# Altium schematic sheet sound.SchDoc: Thymio2
size A4; Organization: Original design LSRO-STI-EPFL; Address1: Association Mobsya; Address2: Michael Bonani; Address3: Ch. Closel 3; Address4: CH-1020 Renens; DocumentNumber: 8; Revision: 2.3; SheetNumber: 8; SheetTotal: 9; Engineer: Michael Bonani; Title2: PCB principal; ProjectName: Name of the project
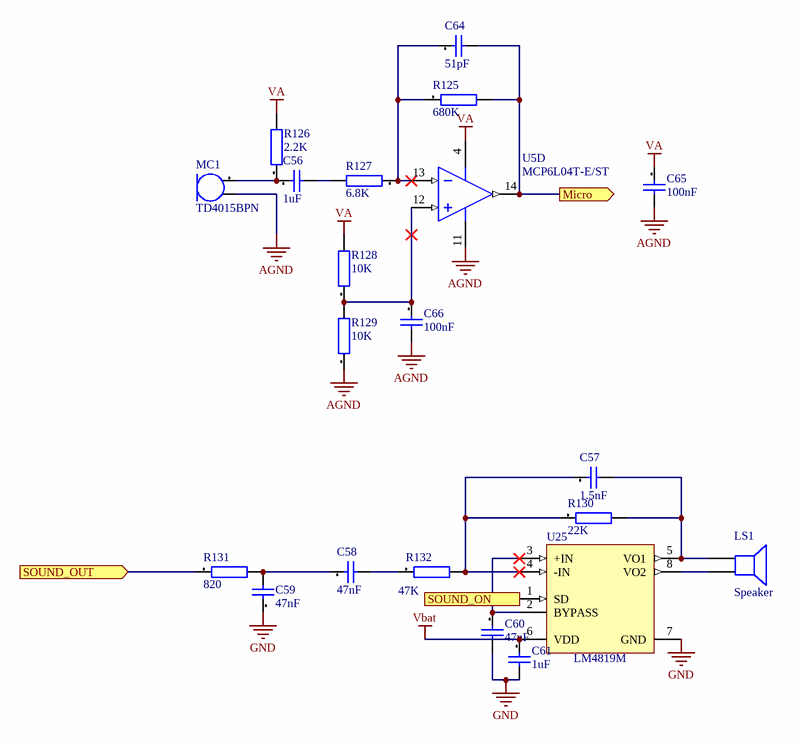
[diagram p0: sound.SchDoc]

## Parts
C56  1uF  [CAPC1005X05N]
C57  1.5nF  [CAPC1005X05N]
C58  47nF  [CAPC1005X05N]
C59  47nF  [CAPC1005X05N]
C60  47nF  [CAPC1005X05N]
C61  1uF  [CAPC1005X05N]
C64  51pF  [CAPC1005X05N]
C65  100nF  [CAPC1005X05N]
C66  100nF  [CAPC1005X05N]
LS1  Speaker  [PIN2]
MC1  TD4015BPN  [MICRO_TD4015BPN]
R125  680K  [RESC1005X04N]
R126  2.2K  [RESC1005X04N]
R127  6.8K  [RESC1005X04N]
R128  10K  [RESC1005X04N]
R129  10K  [RESC1005X04N]
R130  22K  [RESC1005X04N]
R131  820  [RESC1005X04N]
R132  47K  [RESC1005X04N]
U5  MCP6L04T-E/ST  [TSSOP-ST14_N]  (part D of 4)
U25  LM4819M  [M08A_N]

## Ports
Micro (out), SOUND_ON (in), SOUND_OUT (in)

## Nets
AGND: C65.2 C66.2 MC1.2 R129.1 U5.11(VSS)
GND: C59.1 C60.2 C61.2 U25.7(GND)
VA: C65.1 R126.2 R128.2 U5.4(VDD)
Vbat: C61.1 U25.6(VDD)
Micro: C64.2 R125.2 U5.14(VOUTD) ; port Micro
SOUND_ON: U25.1(SD) ; port SOUND_ON
SOUND_OUT: R131.1 ; port SOUND_OUT
NetC56_1: C56.1 MC1.1 R126.1
NetC56_2: C56.2 R127.2
NetC57_1: C57.1 R130.1 R132.2 U25.4(-IN)
NetC57_2: C57.2 LS1.2 R130.2 U25.5(VO1)
NetC58_1: C58.1 C59.2 R131.2
NetC58_2: C58.2 R132.1
NetC60_1: C60.1 U25.2(BYPASS) U25.3(+IN)
NetC64_1: C64.1 R125.1 R127.1 U5.13(VIND-)
NetC66_1: C66.1 R128.1 R129.2 U5.12(VIND+)
NetLS1_1: LS1.1 U25.8(VO2)

## Notes on the sheet
- Date:
- Project
- Part
- Revision:
- File :
- Page
- de

## Library data of the parts
C56 = 4.7uF[[/\]]0603[[/\]]1: Capacitor; Manufacturer: Kemet; Manufacturer Nr: C0603C475K9PAC; Preference: 1; Tolerance +: +10; Tolerance -: -10; Dielectric: X5R; Voltage: 6.3; MaxTemperature: +85; MinTemperature: -55; Quant_1: 10; Quant_2: 100; Quant_3: 1000; Quant_4: 4000; Currentie: CHF; LayerSch: Top; Size: 0603; Footprint Acort: 0603_G; Supplier: Farnell; Supplier Nr: 9227784; ComponentLink2Description: Farnell link; ComponentLink2URL: http://ch.farnell.com/jsp/displayProduct.jsp?sku=9227784; Price_1: 0.33; Price_2: 0.298; Price_3: 0.278; Price_4: 0.246; ROHS: True; DateLastUpdate: 2007-12-03 / 14:22:57
C57 C59 C64 = 10nF[[/\]]0603[[/\]]1: Capacitor; Manufacturer: Multicomp; Manufacturer Nr: U0603R103KCT; Preference: 1; Tolerance +: +10; Tolerance -: -10; Dielectric: X7R; Voltage: 50; MaxTemperature: +125; MinTemperature: -55; Quant_1: 10; Quant_2: 100; Quant_3: 1000; Currentie: CHF; LayerSch: Top; Size: 0603; Footprint Acort: 0603_G; Supplier: Farnell; Supplier Nr: 9406182; ComponentLink2Description: Farnell link; ComponentLink2URL: http://ch.farnell.com/jsp/displayProduct.jsp?sku=9406182; Price_1: 0.062; Price_2: 0.041; Price_3: 0.021; ROHS: True; DateLastUpdate: 2007-12-03 / 14:22:34
C58 C60 = 470nF[[/\]]0603[[/\]]1: Capacitor; Manufacturer: Murata; Manufacturer Nr: GRM188R61C474K; Preference: 1; Tolerance +: +10; Tolerance -: -10; Dielectric: X5R; Voltage: 16; MaxTemperature: +85; MinTemperature: -55; Quant_1: 10; Quant_2: 100; Quant_3: 500; Currentie: CHF; LayerSch: Top; Size: 0603; Footprint Acort: 0603_G; Supplier: Distrelec; Supplier Nr: 823494; ComponentLink2Description: Distrelec link; ComponentLink2URL: http://www.distrelec.com/ishopWebFront/search/luceneSearch.do?dispatch=find&showImage=on&artnrPhrase=823494; Price_1: 0.1797; Price_2: 0.1474; Price_3: 0.1162; ROHS: True; DateLastUpdate: 2007-12-03 / 14:23:01
C61 = 1uF[[/\]]0603[[/\]]1: Capacitor; Manufacturer: Murata; Manufacturer Nr: GRM188R61E105K; Preference: 1; Tolerance +: +10; Tolerance -: -10; Dielectric: X5R; Voltage: 25; MaxTemperature: +85; MinTemperature: -55; Quant_1: 10; Quant_2: 100; Quant_3: 500; Currentie: CHF; LayerSch: Top; Size: 0603; Footprint Acort: 0603_G; Supplier: Distrelec; Supplier Nr: 823495; ComponentLink2Description: Distrelec link; ComponentLink2URL: http://www.distrelec.com/ishopWebFront/search/luceneSearch.do?dispatch=find&showImage=on&artnrPhrase=823495; Price_1: 0.1797; Price_2: 0.1474; Price_3: 0.1162; ROHS: True; DateLastUpdate: 2007-12-03 / 14:22:46
C65 C66 = 100nF[[/\]]0603[[/\]]1: Capacitor; Manufacturer: Kemet; Manufacturer Nr: C0603C104K5RAC; Preference: 1; Tolerance +: +10; Tolerance -: -10; Dielectric: X7R; Voltage: 50; MaxTemperature: +125; MinTemperature: -55; Quant_1: 10; Quant_2: 100; Quant_3: 1000; Quant_4: 4000; Currentie: CHF; LayerSch: Top; Size: 0603; Footprint Acort: 0603_G; Supplier: Farnell; Supplier Nr: 1288255; ComponentLink2Description: Farnell link; ComponentLink2URL: http://ch.farnell.com/jsp/displayProduct.jsp?sku=1288255; Price_1: 0.046; Price_2: 0.04; Price_3: 0.037; Price_4: 0.036; ROHS: True; DateLastUpdate: 2007-12-03 / 14:22:31
LS1 = Speaker: Loudspeaker; LayerSch: Top; Published: 24-Mar-1999; LatestRevisionDate: 17-Jul-2002; LatestRevisionNote: Re-released for DXP Platform.; PackageReference: PIN2; Publisher: Altium Limited
MC1 = Micro1: Omnidirectional Back Electret Condenser Microphone; LayerSch: Top
R125 = 470K[[/\]]0603[[/\]]1: Resistor; Manufacturer: Vishay; Manufacturer Nr: D11CRCW06030B4703F; Tolerance: +/-1; Preference: 1; Power: 0.1; Voltage: 75; Current: 1.5; ppm/K: +/-100; Quant_1: 10; Quant_2: 100; Quant_3: 500; Currentie: CHF; LayerSch: Top; Size: 0603; Footprint Acort: 0603; Supplier: Distrelec; Supplier Nr: 715652; ComponentLink2Description: Distrelec link; ComponentLink2URL: http://www.distrelec.com/ishopWebFront/search/luceneSearch.do?dispatch=find&showImage=on&artnrPhrase=715652; ROHS: True; Price_1: 0.0538; Price_2: 0.0323; Price_3: 0.0204; DateLastUpdate: 2007-12-03 / 16:30:19
R126 = 2.2K[[/\]]0603[[/\]]1: Resistor; Manufacturer: Vishay; Manufacturer Nr: D11CRCW06030B2201F; Tolerance: +/-1; Preference: 1; Power: 0.1; Voltage: 75; Current: 1.5; ppm/K: +/-100; Quant_1: 10; Quant_2: 100; Quant_3: 500; Currentie: CHF; LayerSch: Top; Size: 0603; Footprint Acort: 0603; Supplier: Distrelec; Supplier Nr: 715596; ComponentLink2Description: Distrelec link; ComponentLink2URL: http://www.distrelec.com/ishopWebFront/search/luceneSearch.do?dispatch=find&showImage=on&artnrPhrase=715596; ROHS: True; Price_1: 0.085; Price_2: 0.0603; Price_3: 0.0247; DateLastUpdate: 2009-06-10 / 12:36:43
R127-R129 = 10K[[/\]]0603[[/\]]1: Resistor; Manufacturer: Vishay; Manufacturer Nr: D11CRCW06030B1002F; Tolerance: +/-1; Preference: 1; Power: 0.1; Voltage: 75; Current: 1.5; ppm/K: +/-100; Quant_1: 10; Quant_2: 100; Quant_3: 500; Currentie: CHF; LayerSch: Top; Size: 0603; Footprint Acort: 0603; ComponentLink1Description: OnLine datasheet; Supplier: Distrelec; Supplier Nr: 715612; ComponentLink2Description: Distrelec link; ComponentLink2URL: http://www.distrelec.com/ishopWebFront/search/luceneSearch.do?dispatch=find&showImage=on&artnrPhrase=715612; ROHS: True; Price_1: 0.0538; Price_2: 0.0323; Price_3: 0.0204; DateLastUpdate: 2007-12-03 / 16:29:57
R130-R132 = 22K[[/\]]0603[[/\]]1: Resistor; Manufacturer: Vishay; Manufacturer Nr: D11CRCW06030B2202F; Tolerance: +/-1; Preference: 1; Power: 0.1; Voltage: 75; Current: 1.5; ppm/K: +/-100; Quant_1: 10; Quant_2: 100; Quant_3: 500; Currentie: CHF; LayerSch: Top; Size: 0603; Footprint Acort: 0603; Supplier: Distrelec; Supplier Nr: 715620; ComponentLink2Description: Distrelec link; ComponentLink2URL: http://www.distrelec.com/ishopWebFront/search/luceneSearch.do?dispatch=find&showImage=on&artnrPhrase=715620; ROHS: True; Price_1: 0.0538; Price_2: 0.0323; Price_3: 0.0204; DateLastUpdate: 2007-12-03 / 16:30:04
U5 = MCP6L04T-E/ST: 1 MHz, 85 µA Quad Op Amp, 14-Pin TSSOP, Extended Temperature Range, Tape and Reel; LayerSch: Top; FirstPublished: 2-Dec-2009; DatasheetVersion: revA, Mar-2009; PackageVersion: revBB, Aug-2009; PackageReference: TSSOP-ST14; Publisher: Altium Limited; PackageDescription: 14-Lead Plastic Thin Shrink Small Outline (ST) - 4.4mm Body [TSSOP]; Supplier 1: Digi-Key; Supplier Part Number 1: MCP6L04T-E/STTR-ND; Supplier 2: Digi-Key; Supplier Part Number 2: MCP6L04T-E/STDKR-ND; Supplier 3: Digi-Key; Supplier Part Number 3: MCP6L04T-E/STCT-ND; Supplier 4: Newark; Supplier Part Number 4: 08R1815; ComponentLink1Description: Datasheet; ComponentLink1URL: http://ww1.microchip.com/downloads/en/DeviceDoc/22140a.pdf; ComponentLink2Description: Packaging Specification; ComponentLink2URL: http://www.microchip.com/stellent/groups/techpub_sg/documents/packagingspec/en012702.pdf; ComponentLink3Description: Microchip.com Home; ComponentLink3URL: http://www.microchip.com/
U25 = LM4819M: 350mW Audio Power Amplifier with Shutdown Mode; Manufacturer: National Semiconductor; CompType: Audio IC; PackageTopMarking: NSZXTT*LM48*19M; LayerSch: Top; Published: 4-Dec-2008; DatasheetVersion: Apr-2002; PackageVersion: revL, Sep-2006; PackageReference: M08A; Publisher: Altium Limited; PackageDescription: SOIC Narrow, 4.9 x 3.9 x 1.45mm, 8 Lead, 1.27mm Pitch; PartNumber: LM4819M; RoHS: Y; PinCount: 8; DigiKeyPartNumber: LM4819M-ND; Code_JEDEC: MS-012-AA; Code_IPC: SOIC127P600-8; ComponentLink1Description: LM4819 Datasheet; ComponentLink1URL: http://www.national.com/ds/LM/LM4819.pdf; ComponentLink2Description: LM4819 Web Page; ComponentLink2URL: http://www.national.com/pf/LM/LM4819.html; ComponentLink3Description: M08A Package Page; ComponentLink3URL: http://www.national.com/packaging/folders/m08a.html